# Altium schematic sheet Power_Supply.SchDoc
size A2; SheetNumber: 1; SheetTotal: 6
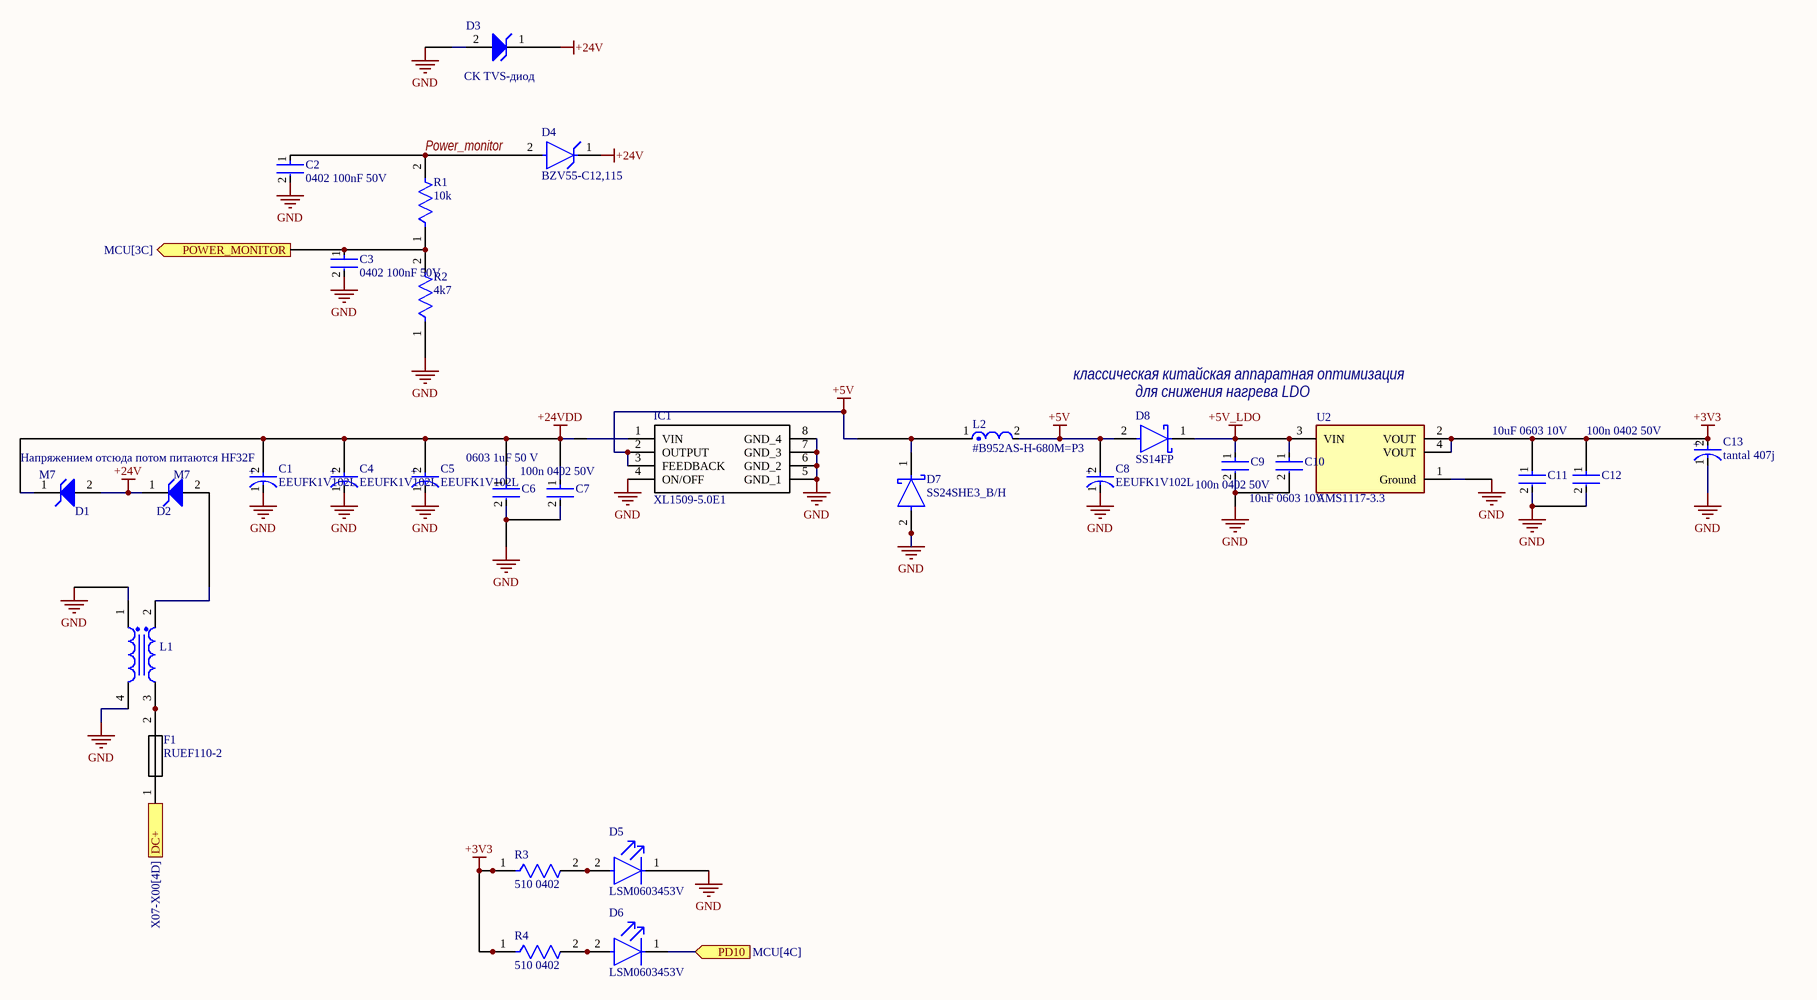
[diagram p0: Power_Supply.SchDoc]

## Parts
C1  EEUFK1V102L  [FP-RAD-TH-D_10_0_5-L_30_2-MFG]
C2  0402 100nF 50V  [FP-0402B104K500CT-IPC_C]
C3  0402 100nF 50V  [FP-0402B104K500CT-IPC_C]
C4  EEUFK1V102L  [FP-RAD-TH-D_10_0_5-L_30_2-MFG]
C5  EEUFK1V102L  [FP-RAD-TH-D_10_0_5-L_30_2-MFG]
C6  0603 1uF 50 V  [FP-CC0603-DB-MFG]
C7  100n 0402 50V  [FP-0402B104K500CT-IPC_C]
C8  EEUFK1V102L  [FP-RAD-TH-D_10_0_5-L_30_2-MFG]
C9  100n 0402 50V  [FP-0402B104K500CT-IPC_C]
C10  10uF 0603 10V  [FP-C0603C106M8PACTU-MFG]
C11  10uF 0603 10V  [FP-C0603C106M8PACTU-MFG]
C12  100n 0402 50V  [FP-0402B104K500CT-IPC_C]
C13  tantal 407j  [FP-TPSB-MFG]
D1  M7  [WE-TVSP_DO-214AC_Unidirectional]
D2  M7  [WE-TVSP_DO-214AC_Unidirectional]
D3  CK TVS-диод  [WE-TVSP_DO-214AC_Unidirectional]
D4  BZV55-C12,115  [FP-SOD80C-MFG]
D5  LSM0603453V  [FP-LSM0603453V-MFG]
D6  LSM0603453V  [FP-LSM0603453V-MFG]
D7  SS24SHE3_B/H  [FP-95400-MFG]
D8  SS14FP  [FP-425AC-MFG]
F1  RUEF110-2  [RUEF1102]
IC1  XL1509-5.0E1  [SOIC127P600X175-8N]
L1  12mH  [WE-TFC_UU9.8V]  (value not drawn)
L2  #B952AS-H-680M=P3  [FP-DS104C2-MFG]
R1  10k  [FP-RT0603-MFG]
R2  4k7  [FP-MCR01-IPC_A]
R3  510 0402  [FP-RMCF0402-MFG]
R4  510 0402  [FP-RMCF0402-MFG]
U2  AMS1117-3.3  [FP-AMS1117-IPC_B]

## Ports
DC+ (in, see X07-X00[4D]), PD10 (in, see MCU[4C]), POWER_MONITOR (out, see MCU[3C])

## Nets
+3V3: C11.1 C12.1 C13.2(A) R3.1 R4.1 U2.2(VOUT) U2.4(VOUT)
+5V: C8.2(A) D7.1(C) D8.2(A) IC1.2(OUTPUT) IC1.3(FEEDBACK) L2.1 L2.2
+5V_LDO: C9.1 C10.1 D8.1(C) U2.3(VIN)
+24V: D1.2(A) D2.1(K) D3.1(K) D4.1(C)
+24VDD: C1.2(A) C4.2(A) C5.2(A) C6.1 C7.1 D1.1(K) IC1.1(VIN)
GND: C1.1(C) C2.2 C3.2 C4.1(C) C5.1(C) C6.2 C7.2 C8.1(C) C9.2 C10.2 C11.2 C12.2 C13.1(C) D3.2(A) D5.1(C) D7.2(A) IC1.4(ON/OFF) IC1.5(GND_1) IC1.6(GND_2) IC1.7(GND_3) IC1.8(GND_4) L1.1 L1.4 R2.1 U2.1(Ground)
DC+: F1.1 ; port DC+
PD10: D6.1(C) ; port PD10
POWER_MONITOR: C3.1 R1.1 R2.2 ; port POWER_MONITOR
Power_monitor: C2.1 D4.2(A) R1.2  [a separate net that carries the same name]
NetD2_2: D2.2(A) L1.2
NetD5_2: D5.2(A) R3.2
NetD6_2: D6.2(A) R4.2
NetF1_2: F1.2 L1.3

## Notes on the sheet
- классическая китайская аппаратная оптимизация
- для снижения нагрева LDO
- (near C1) Напряжением отсюда потом питаются HF32F
- (in symbol CMP-04424-000211-1) +
- (in symbol CMP-05427-000707-1) +

## Library data of the parts
C1 C4 C5 C8 = CMP-05427-000707-1: Aluminum Electrolytic Capacitors (Radial Lead Type) AEC-Q200 Qualified 1000uF ±20% 35V; Lead/Base Style: Straight; Ripple Current: 2.14A; Lead Diameter: 0.6mm; Dissipation Factor: 0.12%; Capacitance: 1mF; Life (Hours): 4000Hour; Dielectric Material: Aluminium; Tolerance: 20%; Height: 30mm; Max Operating Temperature: 105°C; Radiation Hardening: No; Voltage: 35V; Construction: RADIAL; Termination: Radial; Packaging: Bulk; Case/Package: Radial; Package Quantity: 100; Series: FK; Contact Plating: Tin; Voltage Rating (DC): 35V; Mount: Through Hole; RoHS Compliant: Yes; Diameter: 10mm; Lead Pitch: 5mm; REACH SVHC: No SVHC; Min Operating Temperature: -55°C; Voltage Rating: 35V; Length: 30mm
C2 C3 = CMP-45632-000010-1: CAP CER 0.1UF 50V X7R 0402; Tolerance: 10%; Max Operating Temperature: 125°C; Case Code (Metric): 1005; RoHS Compliant: Yes; Series: -; Case Code (Imperial): 0402; Voltage Rating: 50V; Min Operating Temperature: -55°C; Mount: Surface Mount; Capacitance: 100nF; Case/Package: 0402; Packaging: Cut Tape
C6 = CMP-03422-000761-2: CAP CER 1UF 50V X7R 0603; Tolerance: 10%; Lead Free: Lead Free; Max Operating Temperature: 125°C; Width: 0.031inch; Voltage Rating: 50V; Mount: Surface Mount; Resistor Type: Ceramic; Halogen Free: Halogen Free; Weight: 7.1E-05oz; Voltage Rating (DC): 50V; Package Quantity: 4000; Termination: SMD/SMT; Length: 0.063inch; Min Operating Temperature: -55°C; Dielectric: X7R; Case Code (Metric): 1608; Case Code (Imperial): 0603; Packaging: Tape and Reel; Thickness: 0.035inch; Capacitance: 1uF; Case/Package: 0603
C7 C9 C12 = CMP-45632-000010-1: CAP CER 0.1UF 50V X7R 0402; Tolerance: 10%; Capacitance: 100nF; Max Operating Temperature: 125°C; Case Code (Metric): 1005; RoHS Compliant: Yes; Series: -; Case Code (Imperial): 0402; Voltage Rating: 50V; Min Operating Temperature: -55°C; Mount: Surface Mount; Case/Package: 0402; Packaging: Cut Tape
C10 C11 = CMP-03020-034654-1: CAP CER 10UF 10V X5R 0603; RoHS Compliant: Yes
C13 = CMP-04424-000211-1: CAP TANT 100UF 10% 6.3V 1411; Dielectric Material: Tantalum; Leakage Current: 6.3uA; ESR (Equivalent Series Resistance): 400mR; Polarity: Polar; Packaging: Tape and Reel; Lead Free: Lead Free; RoHS Compliant: Yes; Case/Package: 1210; Mount: Surface Mount; Case Code (Metric): 3528; Depth: 2.8mm; Voltage Rating: 6.3V; REACH SVHC: No SVHC; Tolerance: 10%; Max Operating Temperature: 125°C; Package Quantity: 1; Height - Seated (Max): 0.083inch; Min Operating Temperature: -55°C; Case Code (Imperial): 1210; Capacitance: 100uF; Length: 3.5mm; Termination: SMD/SMT; Features: General Purpose; Voltage Rating (DC): 6.3V; Weight: 0.000564oz; Width: 0.11inch; Voltage: 6.3V; Construction: Flat; Series: TPS; Radiation Hardening: No; Height: 1.9mm; Dissipation Factor: 10%
D1 D2 = CMP-03913-71101534-2: Trans Voltage Suppressor Diode, 400W, Unidirectional, 1 Element, Silicon, DO-214AC; Clamping Voltage: 12V; Breakdown Voltage: 8.19V; Power Line Protection: No; Peak Pulse Current: 33.3A; Leakage Current: 200µA; Number of Unidirectional Channels: 1; Reverse Standoff Voltage: 7V; Peak Pulse Power: 400W; Max Operating Temperature: 150°C; Mount: Surface Mount; RoHS: Compliant; Min Breakdown Voltage: 8.19V; Composition: Zener; Min Operating Temperature: -65°C; Length: 4.24mm; Width: 2.67mm; Number of Pins: 2; REACH SVHC: Unknown; Max Breakdown Voltage: 8.19V; Packaging: Cut Tape; Polarity: Unidirectional; Height: 2.25mm
D3 = CMP-03913-71101519-2: TVS diode [Würth Elektronik] 824500281 TVS diode; Clamping Voltage: 45.4V; Polarity: Unidirectional; Reverse Standoff Voltage: 28V; Max Breakdown Voltage: 32.75V; Peak Pulse Power: 400W; Number of Unidirectional Channels: 1; Power Line Protection: No; Peak Pulse Current: 8.8A; Leakage Current: 1µA; Mount: Surface Mount; RoHS: Compliant; Composition: Zener; Number of Pins: 2; Packaging: Cut Tape; Height: 2.25mm; Max Operating Temperature: 150°C; Min Breakdown Voltage: 32.75V; Breakdown Voltage: 32.75V; REACH SVHC: Unknown; Length: 4.24mm; Min Operating Temperature: -65°C; Width: 2.67mm
D4 = CMP-14400-000013-1: DIODE ZENER 12V 500MW SOD80C; Manufacturer: Nexperia; Zener Impedance: 10Ω; Max Zener Voltage: 12.7V; Max Reverse Leakage Current: 0.1uA; Max Junction Temp: +200°C; Power Dissipation: 400mW; Forward Current: 250mA; Reverse Voltage: 8V; Device Class L1: Discrete Semiconductors; Octopart: https://octopart.com/bzv55-c12%2C115-nexperia-78739834; ComponentLink2Description: Datasheet; Automotive: No; ComponentLink2URL: https://assets.nexperia.com/documents/data-sheet/BZV55_SER.pdf; Height: 1.6mm; Lead Free: Yes; Temperature Range Low: -65°C; Mouser Description: Diode Zener Single 12.05V 5% 500mW 2-Pin Mini-MELF T/R; Device Class L3: Zener Diodes; Device Class L2: Diodes; Category: Diode; Package: SOD80C; Manufacturer Part Number: BZV55-C12,115; Footprint Url: https://assets.nexperia.com/documents/outline-drawing/SOD80C.pdf; RoHS: TRUE; Temperature Range High: +200°C; Digikey Description: DIODE ZENER 12V 500MW SOD80C; Nom Zener Voltage: 12V; Temperature: -65°C to +200°C
D5 D6 = CMP-00731-94024739-1: LSM0603453V LED SM 0603 3V -/1000/-mcd Green; Forward Current: 20mA; Forward Voltage: 2.3V; Viewing Angle: 120°; Reverse Voltage: 5V; Power Dissipation: 60mW; Wavelength: 576nm; Luminous Intensity: 120mcd; NexarPartId: 94024739; Height: 550µm; Max Operating Temperature: 85°C; Schedule B: 8541402000, 8541406050; Case/Package: 0603; Color: Green; Min Operating Temperature: -40°C
D7 = CMP-02539-000047-1: DIODE SCHOTTKY 2A 40V DO-214AC; RoHS Compliant: Yes
D8 = CMP-00278-84331602-1: SS14FP Diode Schottky 40V 1A 2-Pin SOD-123HE T/R - Tape and Reel; Manufacturer Lifecycle Status: ACTIVE; Max Junction Temperature (Tj): 150°C; Element Configuration: Single; Capacitance: 54pF; Max Forward Surge Current (Ifsm): 30A; Peak Reverse Current: 400µA; Reverse Recovery Time: 6ns; RoHS: Compliant; Min Operating Temperature: -55°C; Max Operating Temperature: 150°C; Lifecycle Status: Production; Forward Current: 1A; Average Rectified Current: 1A; Mount: Surface Mount; Height: 1mm; Max Repetitive Reverse Voltage (Vrrm): 40V; Weight: 18.4mg; NexarPartId: 84331602; Max Reverse Voltage (DC): 40V; Reverse Voltage: 40V; Schedule B: 8541100080, 8541100080
F1 = RUEF110-2: Fuse; Manufacturer_Name: LITTELFUSE; Datasheet Link: https://www.littelfuse.com/~/media/electronics/product_specifications/resettable_ptcs/littelfuse_ptc_ruef110_product_specification.pdf.pdf; Height: 14.2mm; Manufacturer_Part_Number: RUEF110-2; Mouser Part Number: 650-RUEF110-2; Mouser Price/Stock: https://www.mouser.co.uk/ProductDetail/Littelfuse/RUEF110-2?qs=k5V78Jg%2Feq5PDttMRR0ePQ%3D%3D; Arrow Part Number: RUEF110-2; Arrow Price/Stock: https://www.arrow.com/en/products/ruef110-2/littelfuse?region=nac
IC1 = XL1509-5.0E1: Integrated Circuit; Manufacturer_Name: XLSEMI; Datasheet Link: https://datasheet.lcsc.com/szlcsc/XLSEMI-XL1509-5-0E1_C61063.pdf; Height: 1.75mm; Manufacturer_Part_Number: XL1509-5.0E1
L1 = 744862120: WE-TFC THT Common Mode Power Line Choke, UU9.8V, 12mH, 0.4A, 2Ω; Manufacturer: Wurth Elektronik; Insulation Test Voltage (AC): 2500V; Material: MnZn; Rated Voltage (AC): 300V; ComponentLink1Description: Manufacturer Link; ComponentLink1URL: https://www.we-online.com/redexpert/article/744862120?ad; ComponentLink2Description: Datasheet; ComponentLink2URL: https://www.we-online.com/redexpert/spec/744862120?ad; Manufacturer Part Number: 744862120; Category: Common Mode Chokes; Match Code: WE-TFC; Mount: Through Hole; Operating Temperature Max: 125°C; Operating Temperature Min: -40°C; Packaging: Tray; Case/Size Code: UU9.8V; Length: 17mm; Width: 11.5mm; Height: 17mm; DC Resistance Max: 2Ω; Inductance: 12mH; Rated Current: 0.4A
L2 = CMP-06042-010777-1: Shielded Wirewound Inductor 68uH 20% 1100mA 0.24Ω SMD; Current Rating: 1.1A; Core Material: Ferrite; Test Frequency: 100kHz; DC Resistance (DCR): 240mR; Saturation Current: 1.3A; Width: 0.409inch; Packaging: Tape and Reel; Inductance: 68uH; Max Operating Temperature: 85°C; Case/Package: Nonstandard; Tolerance: 20%; Resistor Type: Wirewound; Mount: Surface Mount; Length: 0.409inch; Min Operating Temperature: -40°C; Height - Seated (Max): 0.19inch; Shielding: Shielded
R1 = CMP-03412-024743-1: RES SMD 10K OHM 0.05% 1/10W 0603; Manufacturer: Yageo; Manufacturer Part Number: RT0603WRE0710KL; Power Rating: 0.1W; Value: 10KΩ; Voltage Rating: 75V; Tolerance: 0.0005; Temperature Coefficient: 50 ppm/°C; Height: 0.55mm; ComponentLink2URL: http://www.yageo.com/documents/recent/PYu-RT_1-to-0.01_RoHS_L_9.pdf; Mouser Description: Res SMD 10K Ohm 0.05% 1/10W 0603; Device Class L1: Passive Components; Octopart: https://octopart.com/rt0603wre0710kl-yageo-71396825; Lead Free: Yes; RoHS: TRUE; ComponentLink2Description: Datasheet; Package: RT0603; Ipc Land Pattern Name: RESC16080X45; Automotive: No; Temperature: -55°C to +155°C; Series: RT; Resistance: 10KΩ; Footprint Url: http://www.yageo.com/exep/pages/download/literatures/PYu-R_Mount_10.pdf; Temperature Range Low: -55°C; Digikey Description: RES SMD 10K OHM 0.05% 1/10W 0603; Category: Res; Device Class L3: Chip SMD Resistors; Temperature Range High: +155°C; Device Class L2: Resistors; Composition: Thin Film
R2 = CMP-08839-002316-1: Thick Film Chip Resistor, 0402, 4.7kΩ, 1%, 100ppm/°C, 0.063W, 50V
R3 R4 = CMP-26527-001818-1: 510Ω ±1% 0.063W 0402 Thick Film Chip Resistor AEC-Q200 compliant; Temperature Coefficient: 100ppm/°C; Max Power Dissipation: 63mW; Resistance: 510R; Series: RMCF; RoHS Compliant: Yes; Features: Automotive AEC-Q200; Contact Plating: Tin; Case Code (Imperial): 0402; Package Quantity: 10000; Max Operating Temperature: 155°C; Height: 0.016inch; Length: 0.039inch; Width: 0.02inch; Number of Terminations: 2; Packaging: Tape and Reel; Mount: Surface Mount; Tolerance: 1%; Min Operating Temperature: -55°C; Case/Package: 0402; Case Code (Metric): 1005; Resistor Type: Thick Film
U2 = CMP-209535-000001-1: LDO Voltage Regulators 1A, 3.3V; Manufacturer: Advanced Monolithic Systems; Dropout Voltage: 1.1V; Output Type: Fixed; Nominal Supply Current: 5mA; Max Power Dissipation: 1.2W; Max Supply Voltage: 15V; Number Of Outputs: 1; Standoff Height: 0.64mm; Max Junction Temp: +125°C; Height: 1.8mm; Package: AMS1117; Device Class L2: Power Management ICs; ComponentLink2Description: Datasheet; ComponentLink2URL: http://www.advanced-monolithic.com/pdf/ds1117.pdf; Category: IC; RoHS: TRUE; Automotive: No; Device Class L1: Integrated Circuits (ICs); Output Current: 1A; Device Class L3: Voltage Regulators - Linear; Temperature: -40°C to +125°C; Output Voltage: 3.3V; Manufacturer Part Number: AMS1117-3.3; Temperature Range Low: -40°C; Octopart: https://octopart.com/ams1117-3.3-advanced+monolithic+systems-25899300; Lead Free: Yes; Ipc Land Pattern Name: SOT229P700X180-4; Temperature Range High: +125°C